# EAGLE design Dyno (EAGLE 4.16)
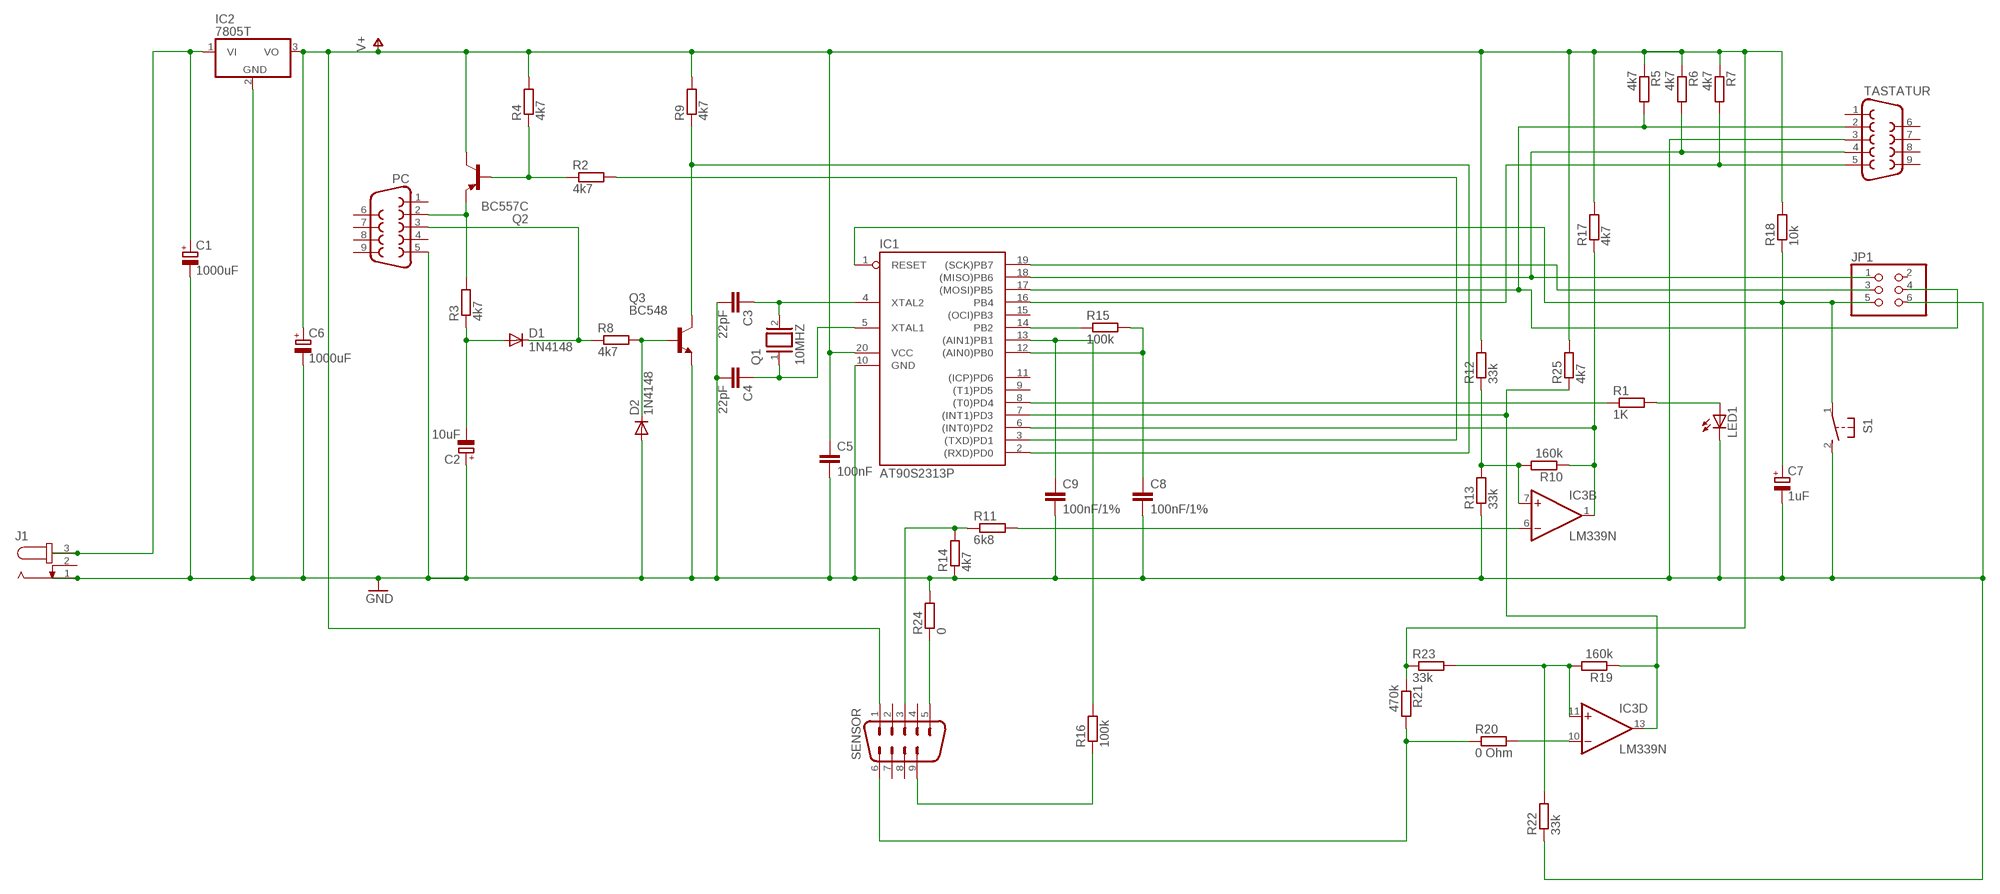
[diagram p0: schematic, sheet 1]

## Parts
C1  1000uF  CPOL-EUE5-10.5  [E5-10,5]
C2  10uF  CPOL-EUE3.5-8  [E3,5-8]
C3  22pF  C-EU050-050X075  [C050-050X075]
C4  22pF  C-EU050-050X075  [C050-050X075]
C5  100nF  C-EU075-042X103  [C075-042X103]
C6  1000uF  CPOL-EUE5-10.5  [E5-10,5]
C7  1uF  CPOL-EUE3.5-8  [E3,5-8]
C8  100nF/1%  C-EU075-042X103  [C075-042X103]
C9  100nF/1%  C-EU075-042X103  [C075-042X103]
D1  1N4148  [DO35-10]
D2  1N4148  [DO35-10]
IC1  AT90S2313P  [DIL20]
IC2  7805T  [TO220H]
IC3  LM339N  [DIL14]
J1  JACK-PLUG1  [SPC4078]
JP1  PINHD-2X3  [2X03]
LED1  LED3MM  [LED3MM]
PC  F09HP  [F09HP]
Q1  10MHZ  XTAL/S  [QS]
Q2  BC557C  [TO92-EBC]
Q3  BC548  [TO92-EBC]
R1  1K  R-EU_0207/10  [0207/10]
R2  4k7  R-EU_0207/10  [0207/10]
R3  4k7  R-EU_0207/10  [0207/10]
R4  4k7  R-EU_0207/10  [0207/10]
R5  4k7  R-EU_0207/10  [0207/10]
R6  4k7  R-EU_0207/10  [0207/10]
R7  4k7  R-EU_0207/10  [0207/10]
R8  4k7  R-EU_0207/10  [0207/10]
R9  4k7  R-EU_0207/10  [0207/10]
R10  160k  R-EU_0207/12  [0207/12]
R11  6k8  R-EU_0207/10  [0207/10]
R12  33k  R-EU_0207/12  [0207/12]
R13  33k  R-EU_0207/12  [0207/12]
R14  4k7  R-EU_0207/12  [0207/12]
R15  100k  R-EU_0207/10  [0207/10]
R16  100k  R-EU_0207/10  [0207/10]
R17  4k7  R-EU_0207/12  [0207/12]
R18  10k  R-EU_0207/12  [0207/12]
R19  160k  R-EU_0207/10  [0207/10]
R20  0 Ohm  R-EU_0207/10  [0207/10]
R21  470k  R-EU_0207/10  [0207/10]
R22  33k  R-EU_0207/10  [0207/10]
R23  33k  R-EU_0207/10  [0207/10]
R24  0  R-EU_0207/10  [0207/10]
R25  4k7  R-EU_0207/10  [0207/10]
S1  31-XX  [B3F-31XX]
SENSOR  M09HP  [M09HP]
TASTATUR  F09HP  [F09HP]

## Nets
GND: C1.- C2.+ C3.2 C4.2 C5.2 C6.- C7.- C8.2 C9.2 D2.A IC1.10(GND) IC2.2(GND) J1.1 JP1.6 LED1.K(C) PC.5 Q3.E R13.1 R14.1 R22.1 R24.2 S1.2(S) TASTATUR.3
N$1: LED1.A R1.2
N$2: C3.1 IC1.4(XTAL2) Q1.2
N$3: C4.1 IC1.5(XTAL1) Q1.1
N$4: Q2.B R2.1 R4.1
N$5: IC3.7(B:+IN) R10.2 R12.1 R13.2
N$6: IC1.19((SCK)PB7) JP1.3
N$7: PC.2 Q2.E R3.2
N$8: C2.- D1.A R3.1
N$9: C7.+ IC1.1(RESET) JP1.5 R18.1 S1.1(P)
N$10: IC1.16(PB4) R7.2 TASTATUR.5
N$11: IC1.17((MOSI)PB5) JP1.4 R5.2 TASTATUR.2
N$12: IC1.18((MISO)PB6) JP1.1 R6.2 TASTATUR.4
N$13: D1.C PC.3 R8.1
N$14: D2.C Q3.B R8.2
N$15: IC1.2((RXD)PD0) Q3.C R9.1
N$16: IC1.3((TXD)PD1) R2.2
N$17: IC1.6((INT0)PD2) IC3.1(B:OUT) R10.1 R17.1
N$18: IC1.8((T0)PD4) R1.1
N$19: IC1.7((INT1)PD3) IC3.13(D:OUT) R19.1 R25.1
N$20: R11.1 R14.2 SENSOR.3
N$21: IC3.6(B:-IN) R11.2
N$22: IC1.14(PB2) R15.1
N$23: IC3.11(D:+IN) R19.2 R22.2 R23.2
N$24: C8.1 IC1.12((AIN0)PB0) R15.2
N$25: C9.1 IC1.13((AIN1)PB1) R16.2
N$26: IC3.10(D:-IN) R20.2
N$27: R20.1 R21.2 SENSOR.6
N$28: R16.1 SENSOR.9
N$29: R24.1 SENSOR.5
N$30: C1.+ IC2.1(VI) J1.3
V+: C5.1 C6.+ IC1.20(VCC) IC2.3(VO) Q2.C R4.2 R5.1 R6.1 R7.1 R9.2 R12.2 R17.2 R18.2 R21.1 R23.1 R25.2 SENSOR.1
Unconnected: IC1.9((T1)PD5) IC1.11((ICP)PD6) IC1.15((OCI)PB3) IC3.2(A:OUT) IC3.4(A:-IN) IC3.5(A:+IN) IC3.8(C:-IN) IC3.9(C:+IN) IC3.14(C:OUT) J1.2 JP1.2 PC.1 PC.4 PC.6 PC.7 PC.8 PC.9 SENSOR.2 SENSOR.4 SENSOR.7 SENSOR.8 TASTATUR.1 TASTATUR.6 TASTATUR.7 TASTATUR.8 TASTATUR.9

## Power pins joined to a net without a drawn wire
GND: IC3.12(P:GND)
V+: IC3.3(P:V+)

## Library data of the parts
C1 C2 C6 C7 = rcl:CPOL-EU: POLARIZED CAPACITOR, European symbol
C3-C5 C8 C9 = rcl:C-EU: CAPACITOR, European symbol
D1 D2 = diode:1N4148: DIODE high speed (Philips)
IC1 = atmel:AT90S2313: MICROCONTROLLER 2 Kbytes FLASH 128 bytes SRAM 128 bytes EEPROM UART
IC2 = linear:78*: Positive VOLTAGE REGULATOR Source: http://cache.national.com/ds/LM/LM78L05.pdf http://www.fairchildsemi.com/ds/LM/LM7805.pdf
IC3 = linear:LM339: Low Power Low Offset Voltage Quad Comparators with open collector; LM139/LM239/LM339/LM2901/LM3302
J1 = con-jack:JACK-PLUG: DC POWER JACK Power Jack, DC, Right Angle, Through Hole, Rated 5A at 16VDC, PC Terminals Distributor: Farnell (www.Farnell.de) Drawing: 84N1161.pdf / 84N1162.pdf Manufacturer: SPC Technology (www.spctechnology.com) Type: SPC4077 / SPC 4078
JP1 = pinhead:PINHD-2X3: PIN HEADER
LED1 = led:LED: LED OSRAM: - CHIPLED LG R971, LG N971, LY N971, LG Q971, LY Q971, LO R971, LY R971 LH N974, LH R974 LS Q976, LO Q976, LY Q976 LO Q996 - Hyper CHIPLED LW Q18S LB Q993, LB Q99A, LB R99A - SideLED LS A670, LO A670, LY A670, LG A670, LP A670 LB A673, LV A673, LT A673, LW A673 LH A674 LY A675 LS A676, LA A676, LO A676, LY A676, LW A676 LS A679, LY A679, LG A679 - Hyper Micro SIDELED® LS Y876, LA Y876, LO Y876, LY Y876 LT Y87S - SmartLED LW L88C, LW L88S LB L89C, LB L89S, LG L890 LS L89K, LO L89K, LY L89K LS L896, LA L896, LO L896, LY L896 - TOPLED LS T670, LO T670, LY T670, LG T670, LP T670 LSG T670, LSP T670, LSY T670, LOP T670, LYG T670 LG T671, LOG T671, LSG T671 LB T673, LV T673, LT T673, LW T673 LH T674 LS T676, LA T676, LO T676, LY T676, LB T676, LH T676, LSB T676, LW T676 LB T67C, LV T67C, LT T67C, LS T67K, LO T67K, LY T67K, LW E67C LS E67B, LA E67B, LO E67B, LY E67B, LB E67C, LV E67C, LT E67C LW T67C LS T679, LY T679, LG T679 LS T770, LO T770, LY T770, LG T770, LP T770 LB T773, LV T773, LT T773, LW T773 LH T774 LS E675, LA E675, LY E675, LS T675 LS T776, LA T776, LO T776, LY T776, LB T776 LHGB T686 LT T68C, LB T68C - Hyper Mini TOPLED® LB M676 - Mini TOPLED Santana® LG M470 LS M47K, LO M47K, LY M47K Source: http://www.osram.convergy.de - LUMILED® LXK2-PW12-R00, LXK2-PW12-S00, LXK2-PW14-U00, LXK2-PW14-V00 LXK2-PM12-R00, LXK2-PM12-S00, LXK2-PM14-U00 LXK2-PE12-Q00, LXK2-PE12-R00, LXK2-PE12-S00, LXK2-PE14-T00, LXK2-PE14-U00 LXK2-PB12-K00, LXK2-PB12-L00, LXK2-PB12-M00, LXK2-PB14-N00, LXK2-PB14-P00, LXK2-PB14-Q00 LXK2-PR12-L00, LXK2-PR12-M00, LXK2-PR14-Q00, LXK2-PR14-R00 LXK2-PD12-Q00, LXK2-PD12-R00, LXK2-PD12-S00 LXK2-PH12-R00, LXK2-PH12-S00 LXK2-PL12-P00, LXK2-PL12-Q00, LXK2-PL12-R00 Source: www.luxeon.com
PC TASTATUR = con-subd:F09: SUB-D
Q1 = special:XTAL/S: CRYSTAL
Q2 = transistor-pnp:BC557*: PNP Transistror
Q3 = transistor-npn:BC548*: NPN Transistor
R1-R25 = rcl:R-EU_: RESISTOR, European symbol
S1 = switch-omron:31-XX: OMRON SWITCH
SENSOR = con-subd:M09: SUB-D

## Board
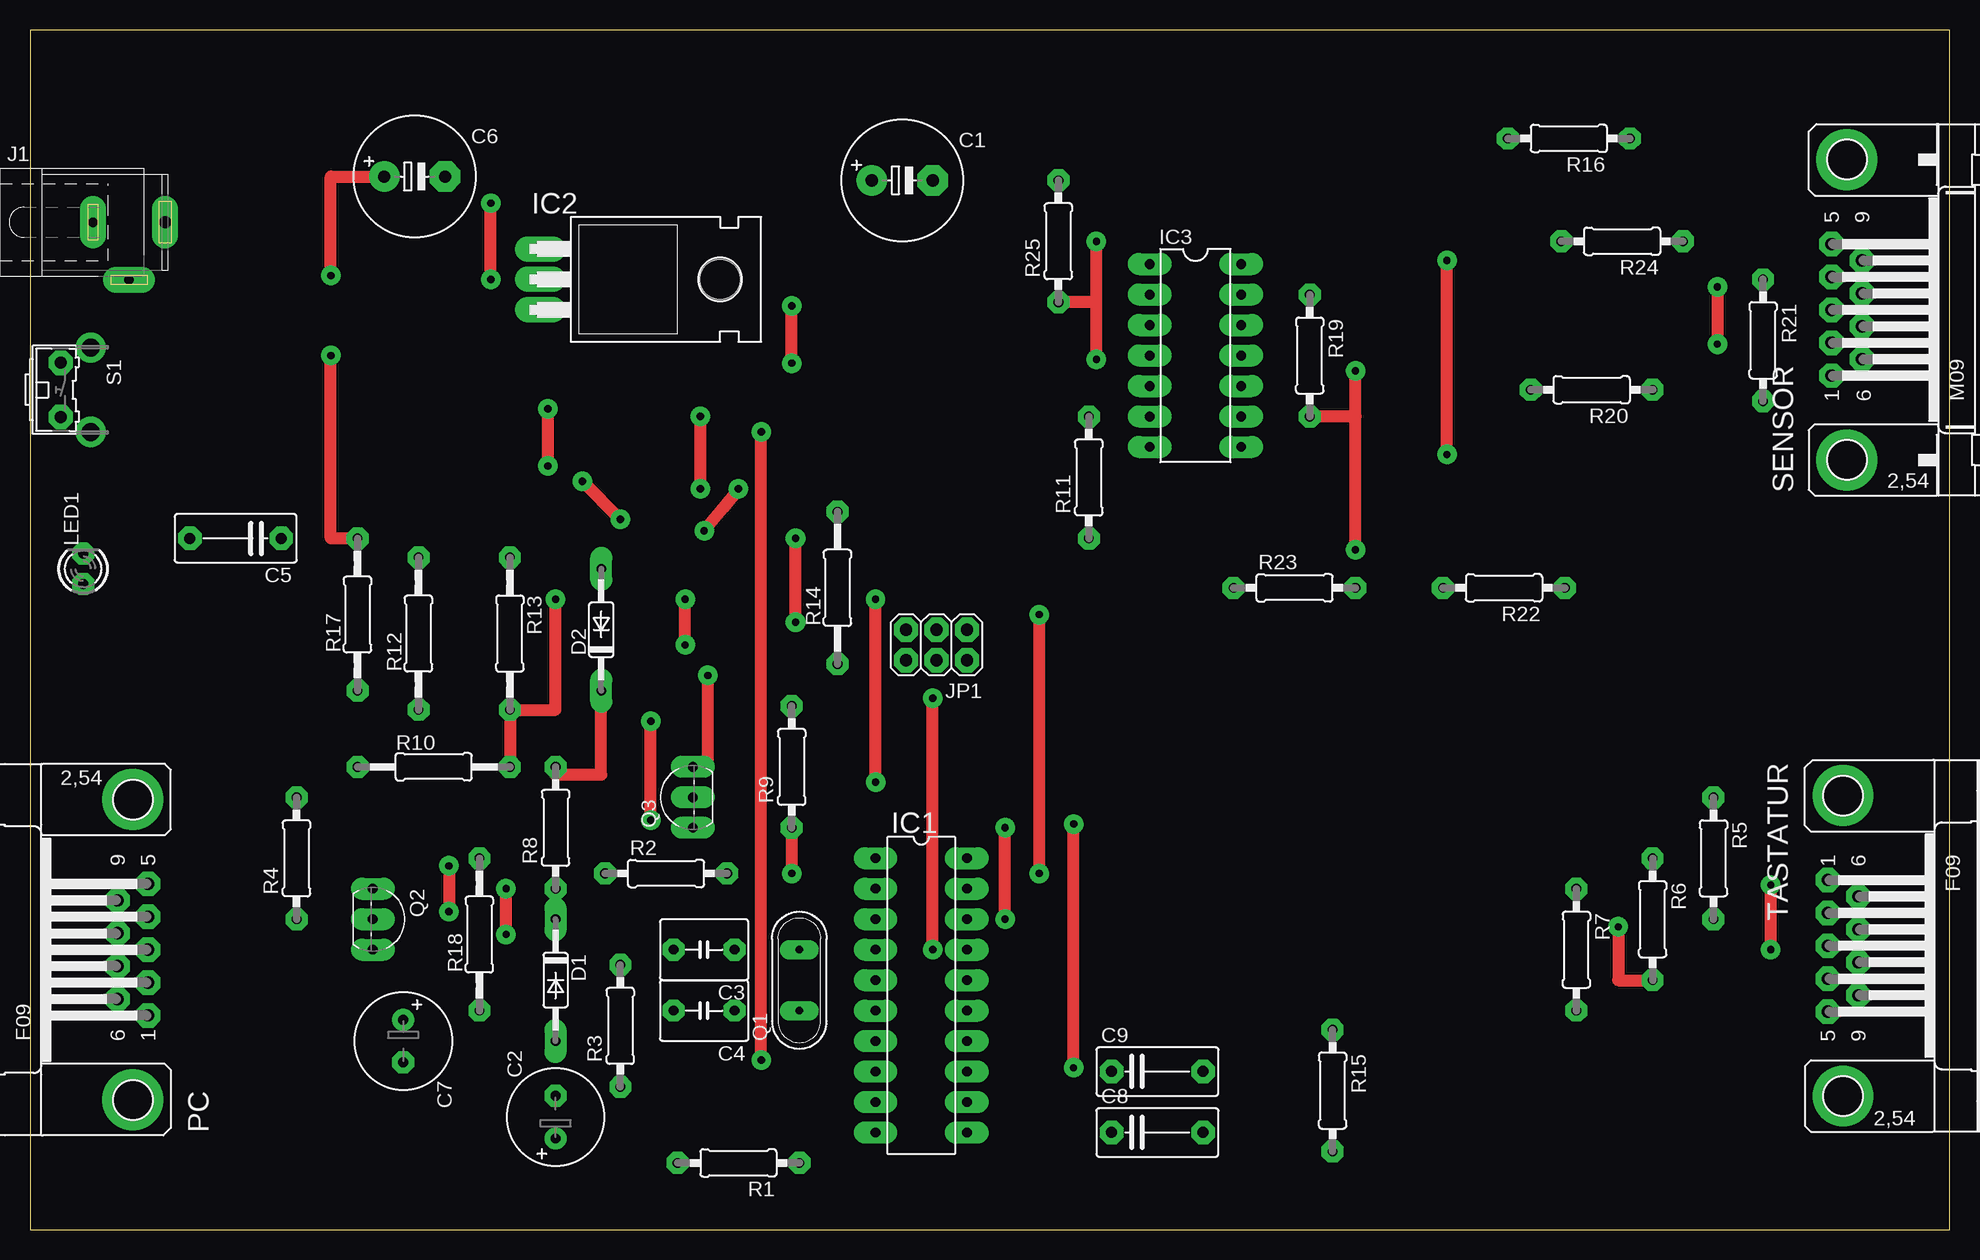
[diagram p1: board, top side]
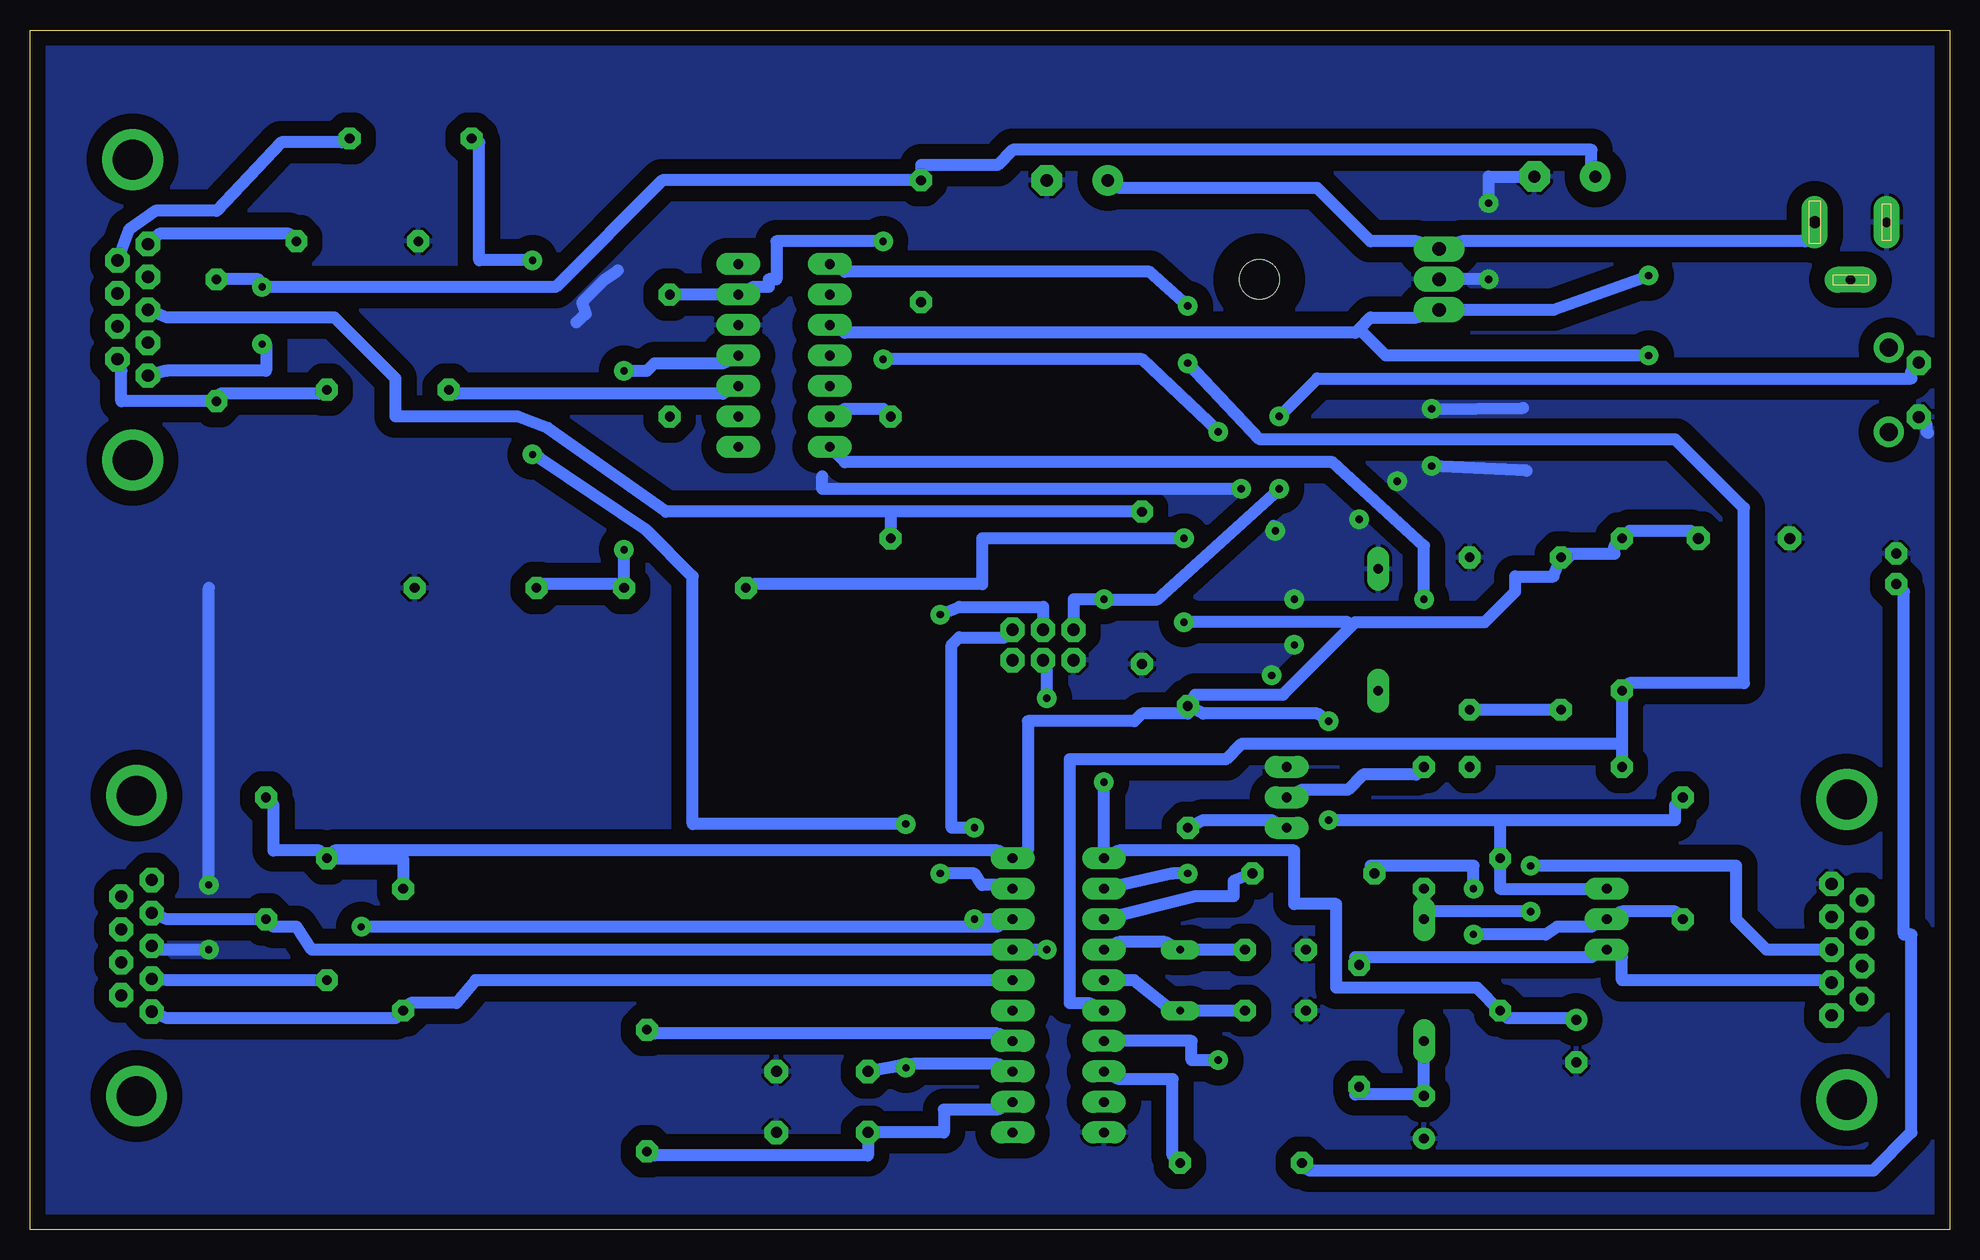
[diagram p2: board, bottom side, seen from below]

Size 160 x 100 mm. Coordinates in mm from the lower left corner, seen from the top.
Outline: 0,0 160,0 160,100 0,100 0,0
Copper layers (1*16): Top 0.035mm / dielectric 1.5mm / Bottom 0.035mm
Design rules "default": minimum track width 40mil, minimum drill 24mil, track to track 10mil, track to pad 10mil, pad to pad 10mil, via to via 10mil, smd to smd 10mil, copper to edge 40mil, drill to drill 8mil, minimum pad ring 20mil, minimum via ring 20mil, stop-mask expansion 4mil, vias tented up to drill 0mil, thermal gap 10mil

### Footprints (pad centres in the part's own frame; a part is rotated, then mirrored left to right if it is on the bottom)
E5-10,5 = drill 1.016 pad 2.54 round: + -2.54,0 | drill 1.016 pad 2.54 octagon: - 2.54,0
E3,5-8 = drill 0.813 pad 1.6 round: + -1.778,0 | drill 0.813 pad 1.6 octagon: - 1.778,0
C050-050X075 = drill 0.813 octagon: 1 -2.54,0; 2 2.54,0
C075-042X103 = drill 0.914 octagon: 1 -3.81,0; 2 3.81,0
DO35-10 = drill 0.813 long: A 5.08,0; C -5.08,0
DIL20 = drill 0.813 long: 1 -11.43,-3.81; 2 -8.89,-3.81; 3 -6.35,-3.81; 4 -3.81,-3.81; 5 -1.27,-3.81; 6 1.27,-3.81; 7 3.81,-3.81; 8 6.35,-3.81; 9 8.89,-3.81; 10 11.43,-3.81; 11 11.43,3.81; 12 8.89,3.81; 13 6.35,3.81; 14 3.81,3.81; 15 1.27,3.81; 16 -1.27,3.81; 17 -3.81,3.81; 18 -6.35,3.81; 19 -8.89,3.81; 20 -11.43,3.81
TO220H = drill 1.118 long: 1 -2.54,-10.16; 2 0,-10.16; 3 2.54,-10.16 | hole 3.302: 0,4.826
DIL14 = drill 0.813 long: 1 -7.62,-3.81; 2 -5.08,-3.81; 3 -2.54,-3.81; 4 0,-3.81; 5 2.54,-3.81; 6 5.08,-3.81; 7 7.62,-3.81; 8 7.62,3.81; 9 5.08,3.81; 10 2.54,3.81; 11 0,3.81; 12 -2.54,3.81; 13 -5.08,3.81; 14 -7.62,3.81
SPC4078 = drill 0.8 pad 2.184 long: 1 -3,0; 2 0,-4.8 | drill 1 pad 2.184 long: 3 3,0
2X03 = drill 1.016 octagon: 1 -2.54,-1.27; 2 -2.54,1.27; 3 0,-1.27; 4 0,1.27; 5 2.54,-1.27; 6 2.54,1.27
LED3MM = drill 0.813 octagon: A -1.27,0; K 1.27,0
F09HP = drill 1.016 octagon: 1 -5.486,-1.27; 2 -2.743,-1.27; 3 0,-1.27; 4 2.743,-1.27; 5 5.486,-1.27; 6 -4.115,1.27; 7 -1.372,1.27; 8 1.372,1.27; 9 4.115,1.27 | drill 3.302 pad 5.08 round: G1 -12.522,0; G2 12.522,0
QS = drill 0.61 long: 1 -2.54,0; 2 2.54,0
TO92-EBC = drill 0.813 long: B 0,-1.27; C -2.54,-1.27; E 2.54,-1.27
0207/10 = drill 0.813 octagon: 1 -5.08,0; 2 5.08,0
0207/12 = drill 0.813 octagon: 1 -6.35,0; 2 6.35,0
B3F-31XX = drill 1.016 octagon: 1 -2.261,-1.245; 2 2.261,-1.245 | drill 1.499 pad 2.159 round: 3 -3.505,1.245; 4 3.505,1.245
M09HP = drill 1.016 octagon: 1 -5.486,1.27; 2 -2.743,1.27; 3 0,1.27; 4 2.743,1.27; 5 5.486,1.27; 6 -4.115,-1.27; 7 -1.372,-1.27; 8 1.372,-1.27; 9 4.115,-1.27 | drill 3.302 pad 5.08 round: G1 -12.522,0; G2 12.522,0

### Placement (x,y rotation side)
C1  72.7,87.47 0 top
C2  43.81,9.36 90 top
C3  56.19,23.33 180 top
C4  56.19,18.25 180 top
C5  17.14,57.62 180 top
C6  32.06,87.78 0 top
C7  31.11,15.71 270 top
C8  93.97,8.09 0 top
C9  93.97,13.17 0 top
D1  43.81,20.79 270 top
D2  47.62,50 90 top
IC1  74.29,19.52 270 top
IC2  52.7,79.21 270 top
IC3  97.15,72.86 270 top
J1  8.25,83.97 0 top
JP1  75.56,48.73 180 top
LED1  4.44,55.08 90 top
PC  8.57,23.33 90 top
Q1  64.13,20.79 90 top
Q2  29.84,25.87 270 top
Q3  53.97,36.03 90 top
R1  59.05,5.55 180 top
R2  53.02,29.68 0 top
R3  49.21,16.98 90 top
R4  22.22,30.95 90 top
R5  140.33,30.95 270 top
R6  135.25,25.87 270 top
R7  128.9,23.33 270 top
R8  43.81,33.49 90 top
R9  63.5,38.57 90 top
R10  33.65,38.57 0 top
R11  88.26,62.7 90 top
R12  32.38,49.68 90 top
R13  40,49.68 270 top
R14  67.3,53.49 90 top
R15  108.58,11.58 270 top
R16  128.27,90.96 180 top
R17  27.3,51.27 90 top
R18  37.46,24.6 90 top
R19  106.67,72.86 270 top
R20  130.17,70 180 top
R21  144.46,74.13 270 top
R22  122.87,53.49 180 top
R23  105.41,53.49 0 top
R24  132.71,82.39 180 top
R25  85.72,82.39 90 top
S1  3.8,70 270 top
SENSOR  151.44,76.67 90 top
TASTATUR  151.12,23.65 270 top

### Tracks (layer width: path | path; a pad name or v marks a point on that pad's centre or on a via)
GND  (via drill 0.6, 0.61)
  Top 1.016: v145.09,23.33 v145.09,28.73 | v38.41,79.21 v38.41,85.56 | v56.51,46.19 56.51,39.2 Q3.E | v54.61,48.73 v54.61,52.54 | v46.03,62.38 v49.21,59.21 | v43.18,63.65 v43.18,68.41 | v59.05,61.75 57.78,60.16 v56.19,58.25
  Bottom 1.016: v145.09,28.73 145.09,53.49 | v145.09,23.33 149.22,23.33 TASTATUR.3 | C6.- 38.41,87.78 v38.41,85.56 | 42.86,79.21 IC2.2 v38.41,79.21 | v56.51,46.19 56.7,46.27 | 54.42,48.54 v54.61,48.73 | v54.61,52.54 54.61,52.62 | v49.21,59.21 49.02,59.39 | v46.03,62.38 46.22,62.2 | S1.2 1.9,67.14 1.9,66.51 1.81,66.41 | 35.24,63.26 v43.18,63.65 | v43.18,68.41 35.55,68.49 | 114.46,75.61 113.66,76.35 113.98,77.3 112.07,79.21 111.12,79.84 111.02,79.95 | v59.05,61.75 93.97,61.75 93.97,62.78 | v56.19,58.25 56.32,58.67
  pour Bottom (isolate 1.27): 0.63,99.53 159.38,99.53 159.38,0.47 0.63,0.47
N$1
  Bottom 1.016: LED1.A 3.8,53.17 3.8,24.6 3.17,24.6 3.17,8.09 6.34,4.92 53.34,4.92 R1.2
N$2
  Bottom 1.016: C3.1 Q1.2 65.4,23.96 69.21,23.96 IC1.4
N$3
  Bottom 1.016: C4.1 Q1.1 64.77,18.25 67.94,20.79 IC1.5
N$4  (via drill 0.61)
  Top 1.016: v39.68,24.6 v39.68,28.41
  Bottom 1.016: R4.1 22.86,26.5 27.3,26.5 Q2.B 29.84,25.23 32.7,25.23 33.65,24.6 v39.68,24.6 | v39.68,28.41 39.68,30.31 48.26,30.31 R2.1
N$5  (via drill 0.61)
  Top 1.016: R10.2 R13.2 43.81,43.33 v43.81,52.54
  Bottom 1.016: v43.81,52.54 43.81,56.98 51.43,63.97 92.07,63.97 IC3.7 | R12.1 R13.2
N$6  (via drill 0.61)
  Top 1.016: v84.13,29.68 v84.13,51.27
  Bottom 1.016: v84.13,29.68 81.27,29.68 80.64,28.73 79.37,28.73 IC1.19 | v84.13,51.27 82.55,51.91 75.56,51.91 JP1.3
N$7
  Bottom 1.016: R3.2 49.53,22.7 29.84,22.7 Q2.E 27.3,22.7 27.3,20.79 10.79,20.79 PC.2
N$8
  Bottom 1.016: R3.1 49.53,11.27 44.45,11.27 C2.- D1.A
N$9  (via drill 0.6, 0.61)
  Top 1.016: v55.88,61.75 v55.88,67.78 | v70.48,37.3 v70.48,52.54
  Bottom 1.016: C7.+ 31.74,17.61 36.83,17.61 R18.1 39.37,20.15 51.11,20.15 51.11,27.14 54.61,27.14 54.61,31.58 69.21,31.58 IC1.1 v70.48,37.3 | v55.88,67.78 52.7,70.95 3.17,70.95 3.17,71.59 S1.1 | v55.88,61.75 66.03,52.54 v70.48,52.54 73.02,52.54 JP1.5
N$10
  Bottom 1.016: IC1.16 122.87,20.79 124.45,18.88 128.27,18.88 R7.2 129.53,17.61 148.59,17.61 TASTATUR.5
N$11  (via drill 0.61)
  Top 1.016: v75.24,23.33 v75.24,44.28
  Bottom 1.016: v75.24,44.28 75.24,46.82 JP1.4 | v75.24,23.33 IC1.17 136.52,23.33 137.79,25.23 139.69,25.23 R5.2 148.59,25.87 TASTATUR.2
N$12  (via drill 0.61)
  Top 1.016: v132.39,25.23 132.39,20.79 R6.2 | v81.27,25.87 v81.27,33.49
  Bottom 1.016: R6.2 148.59,20.79 TASTATUR.4 | v132.39,25.23 79.37,25.23 IC1.18 v81.27,25.87 | v81.27,33.49 83.18,33.49 83.18,48.73 82.55,49.37 78.73,49.37 JP1.1
N$13  (via drill 0.61)
  Top 1.016: v34.92,30.31 v34.92,26.5
  Bottom 1.016: R8.1 D1.C 43.18,26.5 v34.92,26.5 | v34.92,30.31 17.77,30.31 17.77,25.87 15.24,23.33 PC.3
N$14
  Top 1.016: D2.C 47.62,37.94 43.81,37.94 R8.2
  Bottom 1.016: R8.2 44.45,37.94 48.89,37.94 50.16,36.66 53.97,36.66 Q3.B
N$15  (via drill 0.61)
  Top 1.016: R9.1 v63.5,29.68
  Bottom 1.016: Q3.C 56.51,34.12 62.23,34.12 R9.1 | IC1.2 64.77,29.68 v63.5,29.68
N$16
  Bottom 1.016: IC1.3 62.86,27.77 59.69,27.77 59.69,29.04 R2.2
N$17  (via drill 0.61)
  Top 1.016: v63.5,72.22 v63.5,76.99
  Bottom 1.016: 27.3,40.48 R10.1 | 27.3,40.48 R17.1 26.66,45.55 17.14,45.55 17.14,60.16 22.86,65.88 57.46,65.88 v63.5,72.22 | 27.3,40.48 59.05,40.48 60.32,39.2 73.34,39.2 73.34,18.88 71.75,18.88 IC1.6 | v63.5,76.99 66.67,79.84 92.07,79.84 IC3.1
N$18
  Bottom 1.016: R1.1 64.77,6.18 64.77,12.54 69.21,12.54 IC1.8
N$19  (via drill 0.61)
  Top 1.016: v60.96,14.12 v60.96,66.51 | v88.89,72.54 88.89,77.3 | 88.89,77.3 v88.89,82.39 | 88.89,77.3 R25.1
  Bottom 1.016: R19.1 IC3.13 99.69,78.58 98.42,78.58 98.42,79.21 97.78,79.21 97.78,82.39 v88.89,82.39 | v60.96,66.51 67.3,72.54 v88.89,72.54 | v60.96,14.12 63.18,14.12 63.18,15.71 IC1.7
N$20
  Bottom 1.016: R14.2 88.26,59.84 | SENSOR.3 148.59,76.03 134.62,76.03 129.53,70.95 129.53,67.78 119.38,67.78 116.83,66.83 106.99,59.84 88.26,59.84 | 88.26,59.84 R11.1
N$21
  Bottom 1.016: R11.2 88.89,68.41 92.07,68.41 IC3.6
N$22
  Bottom 1.016: IC1.14 79.37,16.34 107.94,16.34 R15.1
N$23  (via drill 0.61)
  Top 1.016: 110.48,67.78 v110.48,71.59 | 110.48,67.78 R19.2 | v110.48,56.67 110.48,67.78
  Bottom 1.016: R22.2 117.47,53.81 111.12,53.81 R23.2 v110.48,56.67 | v110.48,71.59 108.58,71.59 107.94,72.22 102.23,72.22 IC3.11
N$24
  Bottom 1.016: IC1.12 79.37,10 83.81,10 83.81,8.09 C8.1 90.16,6.18 107.94,6.18 R15.2
N$25  (via drill 0.6, 0.61)
  Top 1.016: v118.1,64.61 v118.1,80.8 | v86.99,13.49 v86.99,33.81
  Bottom 1.016: IC1.13 79.37,13.81 86.35,13.81 C9.1 86.99,13.81 v86.99,13.49 | v118.1,80.8 122.55,80.8 122.55,90.64 R16.2 | v118.1,64.61 117.47,64.29 108.58,58.25 104.77,54.45 104.77,33.81 v86.99,33.81
N$26
  Bottom 1.016: R20.2 124.45,69.69 102.23,69.69 IC3.10
N$27
  Bottom 1.016: R20.1 135.88,69.69 144.14,69.69 R21.2 152.39,69.05 152.39,71.59 SENSOR.6
N$28
  Bottom 1.016: R16.1 133.98,90.64 139.06,90.64 144.46,84.92 149.54,84.92 151.76,83.34 SENSOR.9
N$29
  Bottom 1.016: R24.1 138.42,83.02 149.22,83.02 SENSOR.5
N$30
  Bottom 1.016: J1.3 12.06,82.39 40.64,82.39 IC2.1 44.45,82.39 48.26,82.39 52.7,86.83 69.21,86.83 C1.+
V+  (via drill 0.61)
  Top 1.016: v140.65,78.58 v140.65,73.81 | v25.08,79.53 25.08,87.78 C6.+ | v63.81,50.63 v63.81,57.62 | v51.75,34.12 v51.75,42.38 | v25.08,72.86 25.08,57.62 R17.2
  Bottom 1.016: 49.21,75.08 48.26,76.03 44.45,76.03 IC2.3 33.02,76.67 v25.08,79.53 | 49.21,75.08 49.53,74.77 92.07,74.77 IC3.3 | C6.+ 29.84,88.73 29.84,90 78.1,90 79.37,88.73 85.72,88.73 R25.2 107.31,87.47 116.2,78.58 v140.65,78.58 140.97,79.21 R21.1 | v140.65,73.81 140.33,73.81 140.33,71.59 148.59,71.59 SENSOR.1 | R6.1 134.62,31.58 79.37,31.58 IC1.20 76.83,31.58 76.83,42.38 67.94,42.38 67.3,43.02 63.5,43.02 R9.2 | R7.1 128.9,30.95 R6.1 | R5.1 139.69,35.39 139.69,31.58 135.88,31.58 R6.1 | Q2.C 37.46,28.41 R18.2 37.46,34.12 | R4.2 22.86,35.39 22.86,34.12 37.46,34.12 | C5.1 21.58,58.25 26.66,58.25 R17.2 27.93,56.98 27.93,56.35 31.74,56.35 31.74,56.03 R12.2 33.02,54.45 36.19,54.45 36.19,53.17 38.73,50.63 49.53,50.63 49.84,50.32 | 49.84,50.32 55.56,44.6 62.86,44.6 R9.2 | v63.81,57.62 80.64,57.62 80.64,53.81 99.69,53.81 R23.1 | v63.81,50.63 50.16,50.63 49.84,50.32 | v51.75,42.38 52.7,43.02 62.23,43.02 R9.2 | 37.46,34.12 v51.75,34.12 | v25.08,72.86 46.98,72.86 49.21,75.08